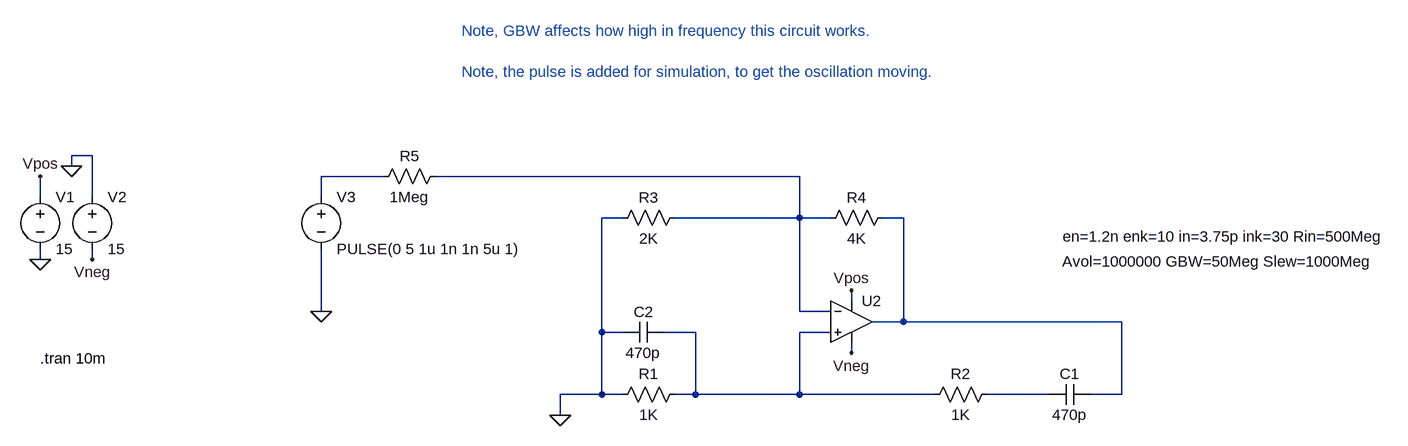
[diagram p0: schematic WienBridgeLT6275.asc]
WienBridgeLT6275.asc, the LTspice schematic file:
Version 4
SHEET 1 1332 916
WIRE -992 304 -1024 304
WIRE -1024 320 -1024 304
WIRE -544 336 -640 336
WIRE 96 336 -464 336
WIRE -1072 368 -1072 336
WIRE -992 368 -992 304
WIRE -640 368 -640 336
WIRE -176 400 -208 400
WIRE 96 400 96 336
WIRE 96 400 -96 400
WIRE 144 400 96 400
WIRE 256 400 224 400
WIRE -1072 464 -1072 448
WIRE -992 464 -992 448
WIRE 176 528 176 512
WIRE -640 544 -640 448
WIRE 96 544 96 400
WIRE 144 544 96 544
WIRE 256 560 256 400
WIRE 256 560 208 560
WIRE 592 560 256 560
WIRE -208 576 -208 400
WIRE -176 576 -208 576
WIRE -64 576 -112 576
WIRE 144 576 96 576
WIRE 176 608 176 592
WIRE -208 672 -208 576
WIRE -208 672 -272 672
WIRE -176 672 -208 672
WIRE -64 672 -64 576
WIRE -64 672 -96 672
WIRE 96 672 96 576
WIRE 96 672 -64 672
WIRE 304 672 96 672
WIRE 480 672 384 672
WIRE 592 672 592 560
WIRE 592 672 544 672
WIRE -272 704 -272 672
FLAG -1072 464 0
FLAG -1072 336 Vpos
FLAG -1024 320 0
FLAG -992 464 Vneg
FLAG 176 512 Vpos
FLAG 176 608 Vneg
FLAG -272 704 0
FLAG -640 544 0
SYMBOL voltage -1072 352 R0
WINDOW 123 0 0 Left 2
WINDOW 39 0 0 Left 2
SYMATTR InstName V1
SYMATTR Value 15
SYMBOL voltage -992 352 R0
WINDOW 123 0 0 Left 2
WINDOW 39 0 0 Left 2
SYMATTR InstName V2
SYMATTR Value 15
SYMBOL res 128 416 R270
WINDOW 0 32 56 VTop 2
WINDOW 3 0 56 VBottom 2
SYMATTR InstName R4
SYMATTR Value 4K
SYMBOL cap 544 656 R90
WINDOW 0 0 32 VBottom 2
WINDOW 3 32 32 VTop 2
SYMATTR InstName C1
SYMATTR Value 470p
SYMATTR SpiceLine V=10 Irms=10.541 Rser=0.004 Lser=0
SYMBOL res -192 688 R270
WINDOW 0 32 56 VTop 2
WINDOW 3 0 56 VBottom 2
SYMATTR InstName R1
SYMATTR Value 1K
SYMBOL res 288 688 R270
WINDOW 0 32 56 VTop 2
WINDOW 3 0 56 VBottom 2
SYMATTR InstName R2
SYMATTR Value 1K
SYMBOL cap -112 560 R90
WINDOW 0 0 32 VBottom 2
WINDOW 3 32 32 VTop 2
SYMATTR InstName C2
SYMATTR Value 470p
SYMATTR SpiceLine V=10 Irms=10.541 Rser=0.004 Lser=0
SYMBOL res -192 416 R270
WINDOW 0 32 56 VTop 2
WINDOW 3 0 56 VBottom 2
SYMATTR InstName R3
SYMATTR Value 2K
SYMBOL voltage -640 352 R0
WINDOW 123 0 0 Left 2
WINDOW 39 0 0 Left 2
SYMATTR InstName V3
SYMATTR Value PULSE(0 5 1u 1n 1n 5u 1)
SYMBOL res -560 352 R270
WINDOW 0 32 56 VTop 2
WINDOW 3 0 56 VBottom 2
SYMATTR InstName R5
SYMATTR Value 1Meg
SYMBOL Opamps\\UniversalOpamp2 176 560 R0
WINDOW 123 324 -93 Left 2
WINDOW 40 325 -131 Left 2
SYMATTR Value2 Avol=1000000 GBW=50Meg Slew=1000Meg
SYMATTR SpiceLine2 en=1.2n enk=10 in=3.75p ink=30 Rin=500Meg
SYMATTR InstName U2
TEXT -1072 616 Left 2 !.tran 10m
TEXT -424 112 Left 2 ;Note, GBW affects how high in frequency this circuit works.\n \nNote, the pulse is added for simulation, to get the oscillation moving.

The netlist it stands for:
* WienBridgeLT6275.asc
V1 Vpos 0 15
V2 0 Vneg 15
R4 N002 N003 4K
C1 N003 N005 470p V=10 Irms=10.541 Rser=0.004 Lser=0
R1 0 N004 1K
R2 N004 N005 1K
C2 N004 0 470p V=10 Irms=10.541 Rser=0.004 Lser=0
R3 0 N002 2K
V3 N001 0 PULSE(0 5 1u 1n 1n 5u 1)
R5 N001 N002 1Meg
XU2 N004 N002 Vpos Vneg N003 level.2 Avol=1000000 GBW=50Meg Slew=1000Meg ilimit=25m rail=0 Vos=0 phimargin=45 en=1.2n enk=10 in=3.75p ink=30 Rin=500Meg  ; pins IN+ IN- V+ V- OUT
.tran 10m
* Note, GBW affects how high in frequency this circuit works.
* Note, the pulse is added for simulation, to get the oscillation moving.
.lib UniversalOpamps2.sub
.backanno
.end